# EAGLE design main (EAGLE 7.3.0)
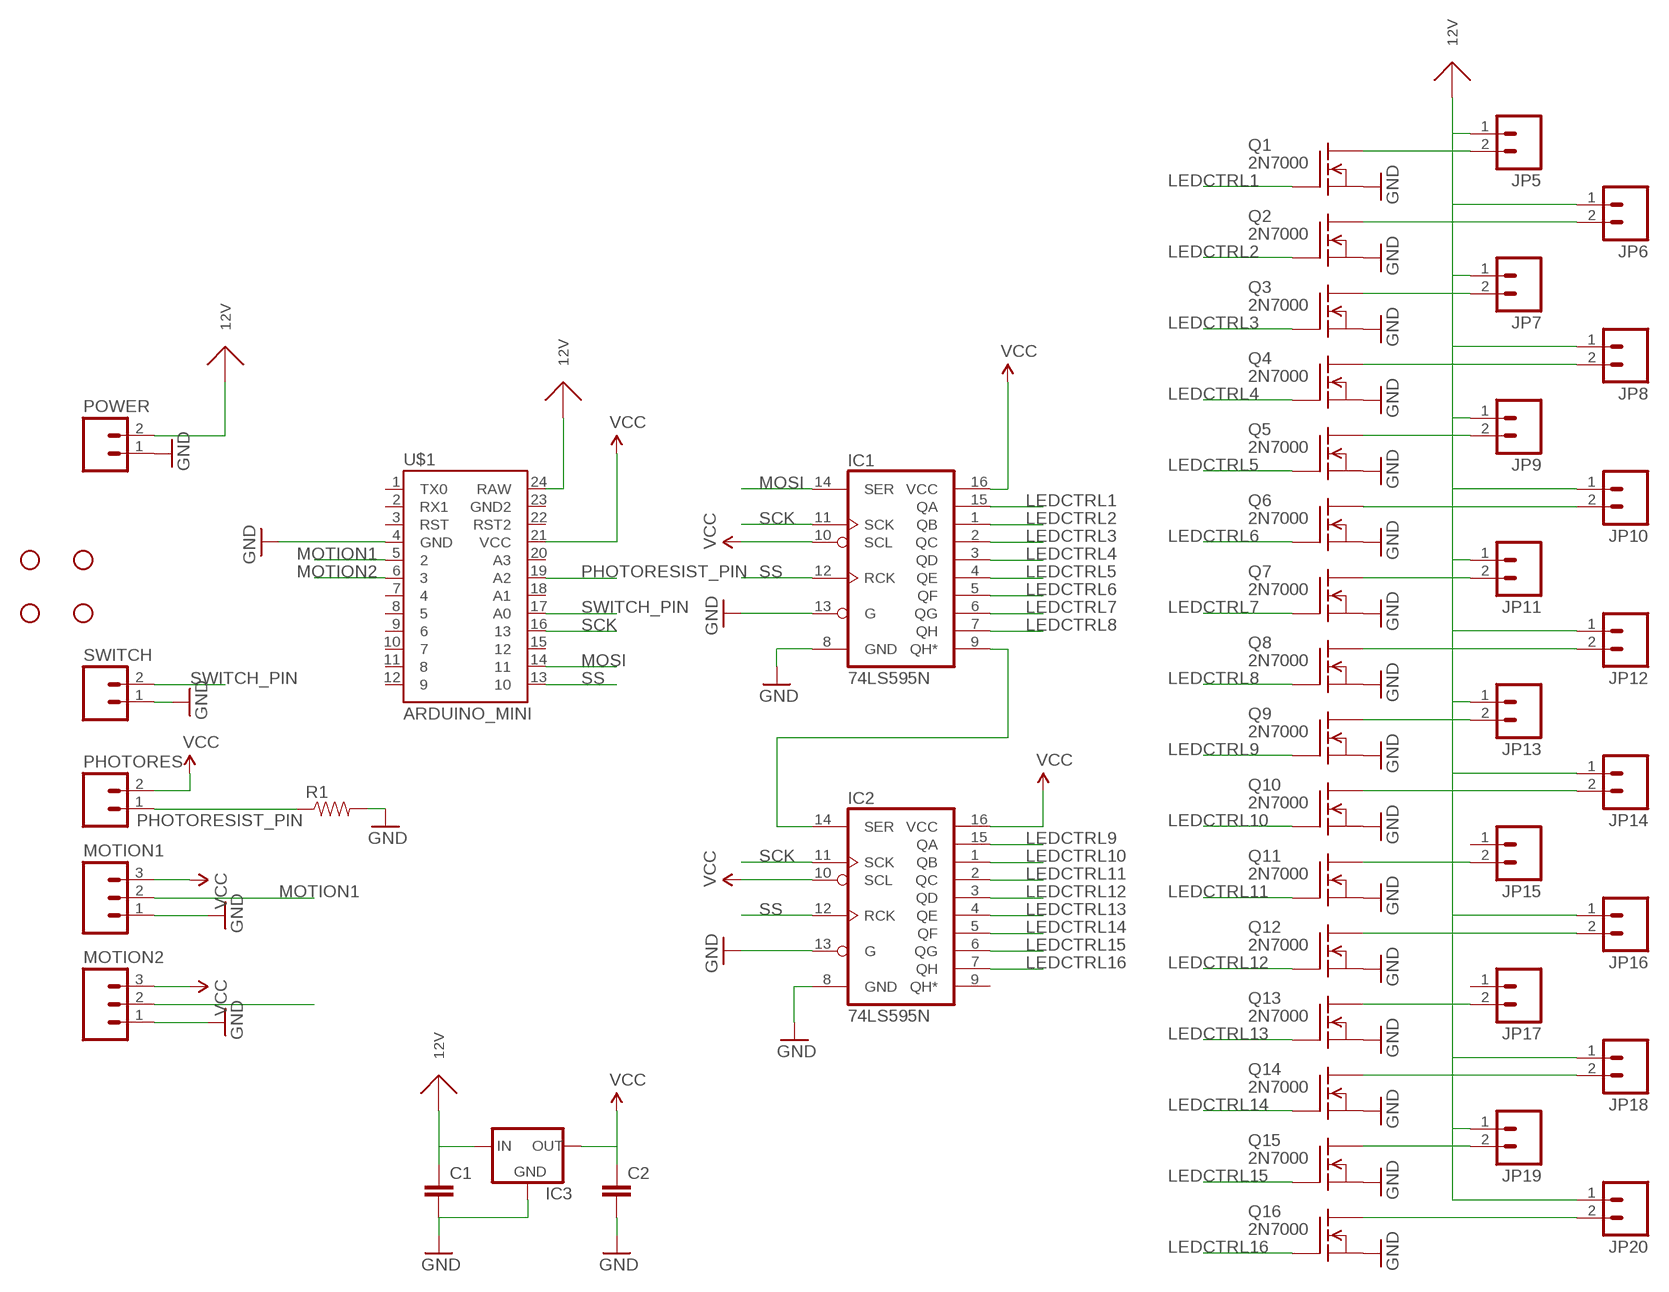
[diagram p0: schematic, sheet 1]

## Parts
C1  CAPKIT  [CAP-PTH-SMALL-KIT]
C2  CAPKIT  [CAP-PTH-SMALL-KIT]
IC1  74LS595N  [DIL16]
IC2  74LS595N  [DIL16]
IC3  V_REG_78XXSINK  [TO220-IGO]
JP1  STAND-OFF  [STAND-OFF]
JP2  STAND-OFF  [STAND-OFF]
JP3  STAND-OFF  [STAND-OFF]
JP4  STAND-OFF  [STAND-OFF]
JP5  M02PTH  [1X02]
JP6  M02PTH  [1X02]
JP7  M02PTH  [1X02]
JP8  M02PTH  [1X02]
JP9  M02PTH  [1X02]
JP10  M02PTH  [1X02]
JP11  M02PTH  [1X02]
JP12  M02PTH  [1X02]
JP13  M02PTH  [1X02]
JP14  M02PTH  [1X02]
JP15  M02PTH  [1X02]
JP16  M02PTH  [1X02]
JP17  M02PTH  [1X02]
JP18  M02PTH  [1X02]
JP19  M02PTH  [1X02]
JP20  M02PTH  [1X02]
MOTION1  M03PTH  [1X03]
MOTION2  M03PTH  [1X03]
PHOTORES  M02PTH  [1X02]
POWER  M025MM  [SCREWTERMINAL-5MM-2]
Q1  2N7000  [TO92]
Q2  2N7000  [TO92]
Q3  2N7000  [TO92]
Q4  2N7000  [TO92]
Q5  2N7000  [TO92]
Q6  2N7000  [TO92]
Q7  2N7000  [TO92]
Q8  2N7000  [TO92]
Q9  2N7000  [TO92]
Q10  2N7000  [TO92]
Q11  2N7000  [TO92]
Q12  2N7000  [TO92]
Q13  2N7000  [TO92]
Q14  2N7000  [TO92]
Q15  2N7000  [TO92]
Q16  2N7000  [TO92]
R1  RESISTORAXIAL-0.3  [AXIAL-0.3]
SWITCH  M02PTH  [1X02]
U$1  ARDUINO_MINI  [ARDUINO_MINI]

## Nets
12V: C1.1 IC3.IN JP5.1 JP6.1 JP7.1 JP8.1 JP9.1 JP10.1 JP11.1 JP12.1 JP13.1 JP14.1 JP16.1 JP18.1 JP19.1 JP20.1 POWER.2 U$1.24(RAW)
GND: C1.2 C2.2 IC1.8(GND) IC1.13(G) IC2.8(GND) IC2.13(G) IC3.GND MOTION1.1 MOTION2.1 POWER.1 Q1.1(S) Q2.1(S) Q3.1(S) Q4.1(S) Q5.1(S) Q6.1(S) Q7.1(S) Q8.1(S) Q9.1(S) Q10.1(S) Q11.1(S) Q12.1(S) Q13.1(S) Q14.1(S) Q15.1(S) Q16.1(S) R1.P$2 SWITCH.1 U$1.4(GND)
LEDCTRL1: IC1.15(QA) Q1.2(G)
LEDCTRL2: IC1.1(QB) Q2.2(G)
LEDCTRL3: IC1.2(QC) Q3.2(G)
LEDCTRL4: IC1.3(QD) Q4.2(G)
LEDCTRL5: IC1.4(QE) Q5.2(G)
LEDCTRL6: IC1.5(QF) Q6.2(G)
LEDCTRL7: IC1.6(QG) Q7.2(G)
LEDCTRL8: IC1.7(QH) Q8.2(G)
LEDCTRL9: IC2.15(QA) Q9.2(G)
LEDCTRL10: IC2.1(QB) Q10.2(G)
LEDCTRL11: IC2.2(QC) Q11.2(G)
LEDCTRL12: IC2.3(QD) Q12.2(G)
LEDCTRL13: IC2.4(QE) Q13.2(G)
LEDCTRL14: IC2.5(QF) Q14.2(G)
LEDCTRL15: IC2.6(QG) Q15.2(G)
LEDCTRL16: IC2.7(QH) Q16.2(G)
MOSI: IC1.14(SER) U$1.14
MOTION1: MOTION1.2 U$1.5
MOTION2: MOTION2.2 U$1.6
N$2: IC1.9(QH*) IC2.14(SER)
N$3: JP5.2 Q1.3(D)
N$4: JP6.2 Q2.3(D)
N$5: JP7.2 Q3.3(D)
N$6: JP8.2 Q4.3(D)
N$7: JP9.2 Q5.3(D)
N$8: JP10.2 Q6.3(D)
N$9: JP11.2 Q7.3(D)
N$10: JP12.2 Q8.3(D)
N$11: JP13.2 Q9.3(D)
N$12: JP14.2 Q10.3(D)
N$13: JP15.2 Q11.3(D)
N$14: JP16.2 Q12.3(D)
N$15: JP17.2 Q13.3(D)
N$16: JP18.2 Q14.3(D)
N$17: JP20.2 Q16.3(D)
N$18: JP19.2 Q15.3(D)
PHOTORESIST_PIN: PHOTORES.1 R1.P$1 U$1.19(A2)
SCK: IC1.11(SCK) IC2.11(SCK) U$1.16
SS: IC1.12(RCK) IC2.12(RCK) U$1.13
SWITCH_PIN: SWITCH.2 U$1.17(A0)
VCC: C2.1 IC1.10(SCL) IC1.16(VCC) IC2.10(SCL) IC2.16(VCC) IC3.OUT MOTION1.3 MOTION2.3 PHOTORES.2 U$1.21(VCC)
Unconnected: IC2.9(QH*) JP15.1 JP17.1 U$1.1(TX0) U$1.2(RX1) U$1.3(RST) U$1.7 U$1.8 U$1.9 U$1.10 U$1.11 U$1.12 U$1.15 U$1.18(A1) U$1.20(A3) U$1.22(RST2) U$1.23(GND2)

## Library data of the parts
C1 C2 = SparkFun:CAP: Capacitor Standard 0603 ceramic capacitor, and 0.1" leaded capacitor.
IC1 IC2 = SparkFun:74*595: 8-bit SHIFT REGISTER, output latch
IC3 = SparkFun:V_REG_78XX: Voltage Regulator Standard 7805 5V regulator. IGO (Input Ground Output). Spark Fun Electronics SKU : COM-00107
JP1-JP4 = SparkFun:STAND-OFF: Stand Off This is the mechanical footprint for a #4 phillips button head screw. Use the keepout ring to avoid running the screw head into surrounding components. SKU : PRT-00447
JP5-JP20 PHOTORES POWER SWITCH = SparkFun:M02: Header 2 Standard 2-pin 0.1" header. Use with straight break away headers (SKU : PRT-00116), right angle break away headers (PRT-00553), swiss pins (PRT-00743), machine pins (PRT-00117), and female headers (PRT-00115). Molex polarized connector foot print use with SKU : PRT-08233 with associated crimp pins and housings.
MOTION1 MOTION2 = SparkFun:M03: Header 3 Standard 3-pin 0.1" header. Use with straight break away headers (SKU : PRT-00116), right angle break away headers (PRT-00553), swiss pins (PRT-00743), machine pins (PRT-00117), and female headers (PRT-00115). Molex polarized connector foot print use with SKU : PRT-08232 with associated crimp pins and housings.
Q1-Q16 = com.andrew.eagleLibrary:2N7000: N-Channel Enhancement MOSFET not checked
R1 = SparkFun:RESISTOR: Resistor Basic schematic elements and footprints for 0603, 1206, and PTH resistors.
U$1 = SparkFun:ARDUINO_MINI

## Board
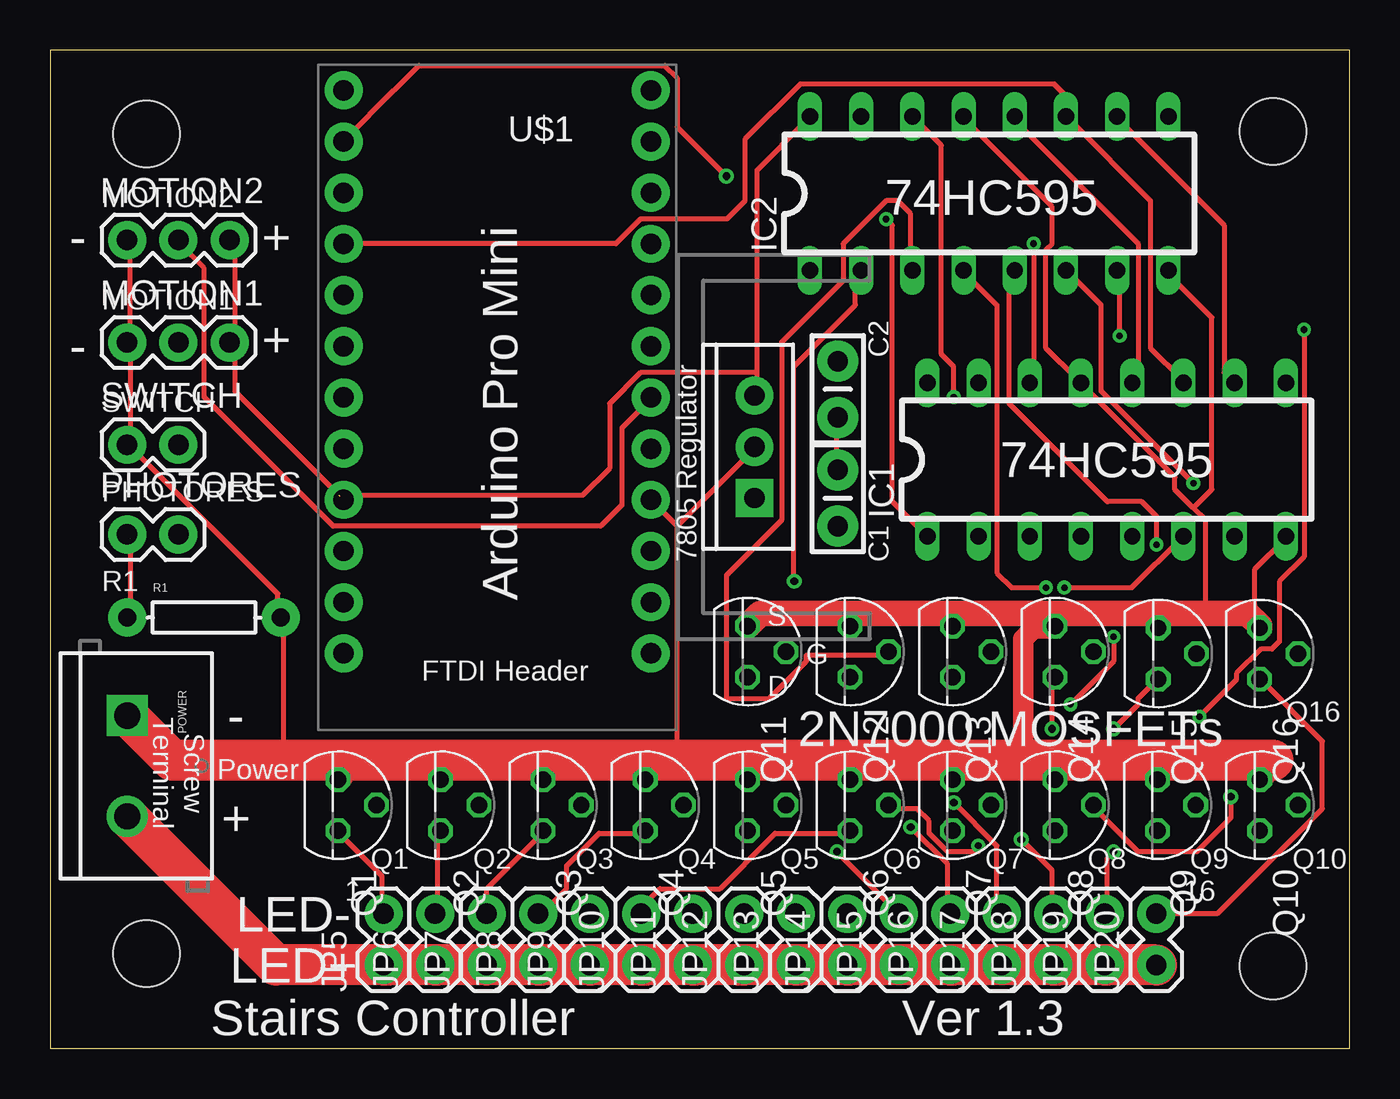
[diagram p1: board, top side]
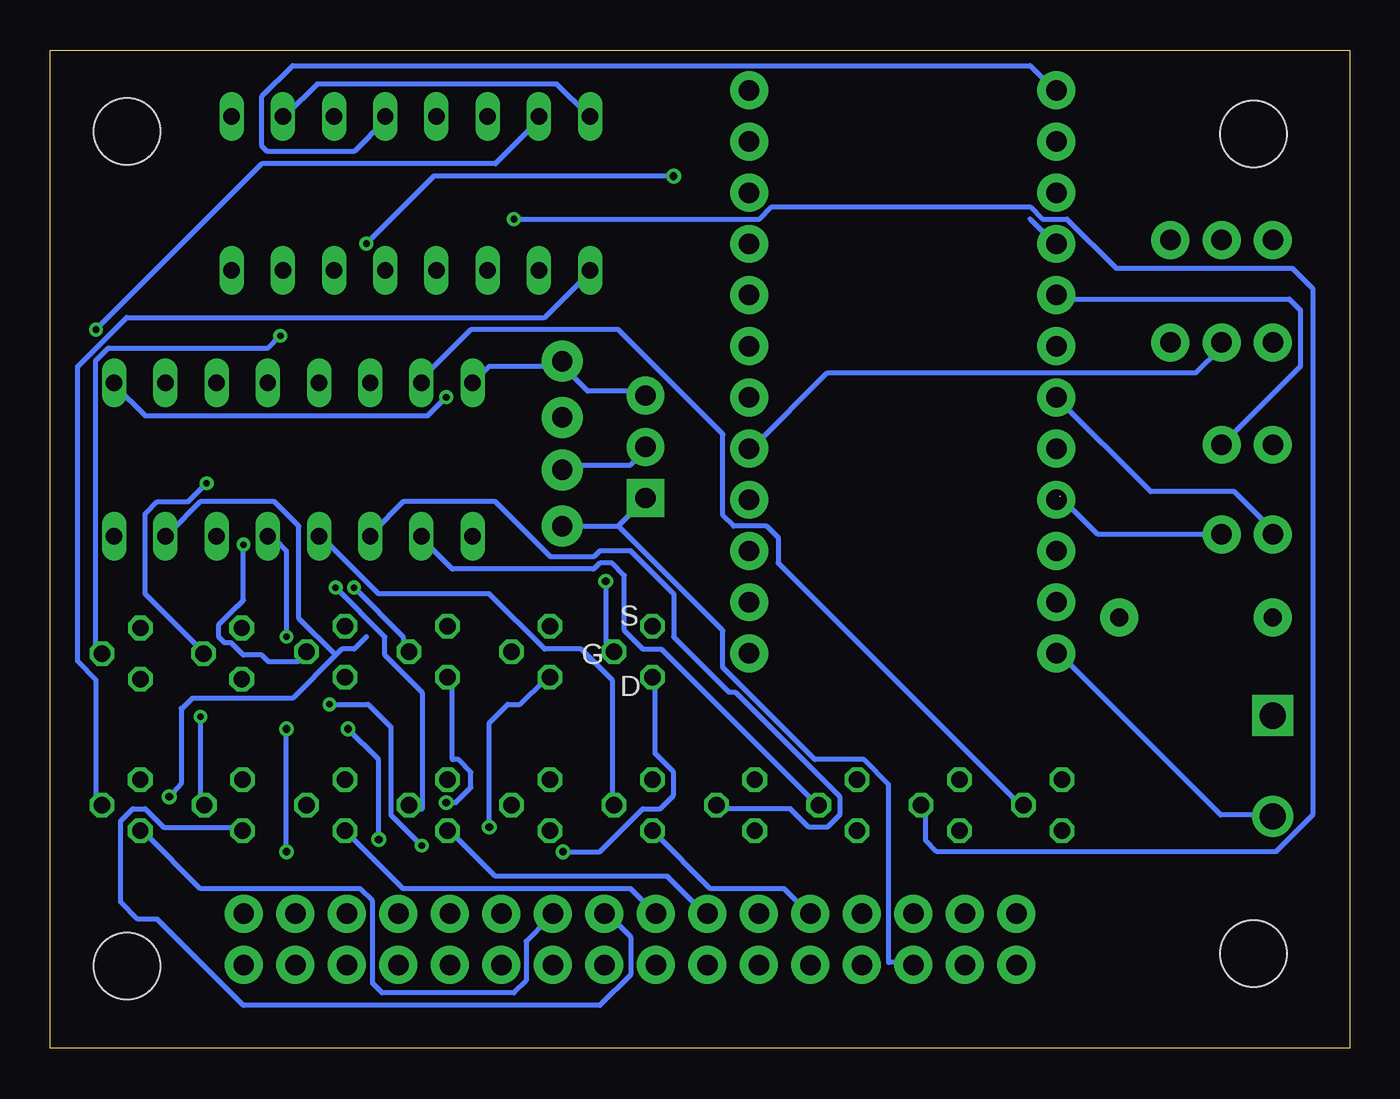
[diagram p2: board, bottom side, seen from below]

Size 64.44 x 49.52 mm. Coordinates in mm from the lower left corner, seen from the top.
Outline: 0,0 64.44,0 64.44,49.52 0,49.52 0,0
Copper layers (1*16): Top 0.0356mm / dielectric 1.5011mm / Bottom 0.0356mm
Design rules "LaenPCBOrder *": minimum track width 10mil, minimum drill 13mil, track to track 6mil, track to pad 6mil, pad to pad 6mil, via to via 6mil, smd to smd 6mil, copper to edge 15mil, drill to drill 6mil, minimum pad ring 7mil, minimum via ring 7mil, stop-mask expansion 4mil, vias tented up to drill 0mil, thermal gap 10mil

### Footprints (pad centres in the part's own frame; a part is rotated, then mirrored left to right if it is on the bottom)
CAP-PTH-SMALL-KIT = drill 1.016 pad 2.032: 1 -1.397,0; 2 1.397,0
DIL16 = drill 0.813 long: 1 -8.89,-3.81; 2 -6.35,-3.81; 3 -3.81,-3.81; 4 -1.27,-3.81; 5 1.27,-3.81; 6 3.81,-3.81; 7 6.35,-3.81; 8 8.89,-3.81; 9 8.89,3.81; 10 6.35,3.81; 11 3.81,3.81; 12 1.27,3.81; 13 -1.27,3.81; 14 -3.81,3.81; 15 -6.35,3.81; 16 -8.89,3.81
TO220-IGO = drill 1 pad 1.88: GND 0,0; OUT 2.54,0 | drill 1 pad 1.88 square: IN -2.54,0
STAND-OFF = hole 3.302: 0,0
1X02 = drill 1.016 pad 1.88: 1 0,0; 2 2.54,0
1X03 = drill 1.016 pad 1.88: 1 0,0; 2 2.54,0; 3 5.08,0
SCREWTERMINAL-5MM-2 = drill 1.3 pad 2.032 square: 1 0,0 | drill 1.3 pad 2.032: 2 5,0
TO92 = drill 0.813 octagon: 1 -1.27,0; 2 0,1.905; 3 1.27,0
AXIAL-0.3 = drill 0.9 pad 1.88: P$1 -3.81,0; P$2 3.81,0
ARDUINO_MINI = drill 1.016 pad 1.88: 1 -7.62,12.7; 2 -7.62,10.16; 3 -7.62,7.62; 4 -7.62,5.08; 5 -7.62,2.54; 6 -7.62,0; 7 -7.62,-2.54; 8 -7.62,-5.08; 9 -7.62,-7.62; 10 -7.62,-10.16; 11 -7.62,-12.7; 12 -7.62,-15.24; 13 7.62,-15.24; 14 7.62,-12.7; 15 7.62,-10.16; 16 7.62,-7.62; 17 7.62,-5.08; 18 7.62,-2.54; 19 7.62,0; 20 7.62,2.54; 21 7.62,5.08; 22 7.62,7.62; 23 7.62,10.16; 24 7.62,12.7

### Placement (x,y rotation side)
C1  39.05,27.3 90 top
C2  39.05,32.7 270 top
IC1  52.39,29.21 0 top
IC2  46.56,42.42 0 top
IC3  34.92,29.84 90 top
JP1  60.65,45.5 0 top
JP2  4.77,45.38 0 top
JP3  60.65,4.09 0 top
JP4  4.77,4.71 0 top
JP5  16.52,4.13 90 top
JP6  19.08,4.13 90 top
JP7  21.64,4.13 90 top
JP8  24.19,4.13 90 top
JP9  26.75,4.13 90 top
JP10  29.3,4.13 90 top
JP11  31.86,4.13 90 top
JP12  34.41,4.13 90 top
JP13  36.97,4.13 90 top
JP14  39.52,4.13 90 top
JP15  42.08,4.13 90 top
JP16  44.63,4.13 90 top
JP17  47.19,4.13 90 top
JP18  49.74,4.13 90 top
JP19  52.3,4.13 90 top
JP20  54.85,4.13 90 top
MOTION1  3.81,35.03 0 top
MOTION2  3.81,40.11 0 top
PHOTORES  3.81,25.5 0 top
POWER  3.81,16.51 270 top
Q1  14.27,12.06 270 top
Q2  19.34,12.06 270 top
Q3  24.43,12.06 270 top
Q4  29.5,12.06 270 top
Q5  34.59,12.06 270 top
Q6  39.66,12.06 270 top
Q7  44.74,12.06 270 top
Q8  49.83,12.06 270 top
Q9  54.91,12.06 270 top
Q10  59.98,12.06 270 top
Q11  34.59,19.68 270 top
Q12  39.66,19.68 270 top
Q13  44.74,19.68 270 top
Q14  49.83,19.68 270 top
Q15  54.95,19.59 270 top
Q16  59.98,19.59 270 top
R1  7.62,21.37 0 top
SWITCH  3.81,29.95 0 top
U$1  22.16,32.3 180 top

### Tracks (layer width: path | path; a pad name or v marks a point on that pad's centre or on a via)
12V
  Top 0.254: JP5.1 16.76,4.27 16.76,4.13 | 34.14,4.13 34.14,4.27 JP12.1 | JP6.1 19.2,4.27 19.2,4.13 | JP7.1 21.64,4.27 JP7.1 | JP8.1 24.38,4.27 24.38,4.13 | JP9.1 26.82,4.27 26.82,4.13 | JP10.1 29.57,4.27 29.57,4.13 | JP11.1 32,4.27 32,4.13 | JP13.1 37.19,4.27 37.19,4.13 | JP14.1 39.62,4.27 39.62,4.13 | JP16.1 44.81,4.27 44.81,4.13 | JP18.1 49.99,4.27 49.99,4.13 | JP19.1 52.43,4.27 52.43,4.13
  Top 2.032: JP20.1 52.43,4.13 JP19.1 49.99,4.13 JP18.1 44.81,4.13 JP16.1 39.62,4.13 JP14.1 37.19,4.13 JP13.1 JP12.1 34.14,4.13 32,4.13 JP11.1 29.57,4.13 JP10.1 26.82,4.13 JP9.1 24.38,4.13 JP8.1 JP7.1 19.2,4.13 JP6.1 16.76,4.13 JP5.1 11.19,4.13 POWER.2
  Bottom 0.254: U$1.24 14.33,19.51 6.4,11.58 3.96,11.58 POWER.2 | 36.27,25.91 35.05,27.13 IC3.IN | C1.1 36.27,25.91 | 36.27,25.91 31.09,20.73 31.09,18.9 26.52,14.33 24.08,14.33 22.86,13.11 22.86,4.27 21.64,4.27 JP7.1
GND
  Top 0.254: MOTION2.1 3.96,39.93 3.96,35.05 MOTION1.1 3.96,34.75 3.96,30.18 SWITCH.1 3.96,29.87 11.28,22.55 11.28,21.64 R1.P$2 11.58,21.34 11.58,14.29 | Q15.1 55.17,21.03 55.17,21.59 | Q2.1 19.51,13.41 19.51,14.29 | 54.86,14.29 54.86,13.41 Q9.1 | Q3.1 24.38,13.41 24.38,14.29 | Q4.1 29.57,13.41 29.57,14.29 | Q5.1 34.75,13.41 34.75,14.29 | Q6.1 39.62,13.41 39.62,14.29 | Q7.1 44.81,13.41 44.81,14.29 | Q8.1 49.99,13.41 49.99,14.29 | 48.46,21.59 48.46,21.34 48.9,20.95 | Q12.1 39.62,21.03 39.62,21.59 | Q13.1 44.81,21.03 44.81,21.59 | 31.09,25.91 29.87,27.13 U$1.4 | 31.09,14.29 31.09,25.91 | C2.2 39.01,31.09 39.01,28.96 C1.2 | 56.69,26.82 57.3,26.21 57.3,21.59 | 56.69,26.82 55.78,27.74 55.78,28.35 51.21,32.92 IC1.13 50.9,33.22 49.38,34.75 49.38,39.62 49.68,39.93 49.68,41.76 45.41,46.02 IC2.13 | 56.69,26.82 57.61,27.74 57.61,36.27 55.47,38.41 IC2.8 | IC1.8 61.27,25.3 59.74,23.77 59.74,21.95 59.37,21.59 | 31.09,25.91 34.75,29.57 IC3.GND
  Top 1.016: 48.9,20.95 48.26,20.32 48.26,14.92
  Top 1.27: Q16.1 59.98,20.98 59.37,21.59 57.3,21.59 55.17,21.59 48.46,21.59 44.81,21.59 39.62,21.59 35.22,21.59 Q11.1 | Q10.1 59.98,13.36 60.64,14.29 | 14.9,14.29 Q1.1 | Q14.1 48.9,20.95 | 48.26,14.92 46.67,14.29
  Top 2.032: 60.64,14.29 54.86,14.29 49.99,14.29 46.67,14.29 44.81,14.29 39.62,14.29 34.75,14.29 31.09,14.29 29.57,14.29 24.38,14.29 19.51,14.29 14.9,14.29 11.58,14.29 6.03,14.29 POWER.1
  Bottom 0.254: IC3.GND 35.05,29.57 35.66,28.96 39.01,28.96 C1.2
LEDCTRL1
  Bottom 0.254: Q1.2 16.46,12.19 28.35,24.08 28.35,25.35 28.9,25.91 30.56,25.91 31.09,26.44 31.09,30.48 36.27,35.66 43.59,35.66 46.02,33.22 IC1.15
LEDCTRL2  (via drill 0.33)
  Top 0.254: v41.45,41.15 41.76,40.84 41.76,27.13 43.28,25.6 IC1.1
  Bottom 0.254: v41.45,41.15 29.26,41.15 28.65,41.76 15.85,41.76 15.24,41.15 14.02,41.15 11.58,38.71 2.84,38.71 1.83,37.7 1.83,11.58 3.66,9.75 20.46,9.75 21.03,10.32 21.03,11.89 Q2.2
LEDCTRL3
  Bottom 0.254: Q3.2 26.52,12.19 34.14,19.81 35.05,19.81 35.97,20.73 35.97,23.47 36.58,24.08 37.19,24.08 37.49,23.77 44.5,23.77 46.02,25.3 IC1.2
LEDCTRL4
  Bottom 0.254: Q4.2 31.39,11.89 27.74,11.89 26.82,10.97 25.91,10.97 25.3,11.58 25.3,12.5 30.48,17.68 30.79,17.68 33.53,20.42 33.53,22.55 35.66,24.69 37.19,24.69 37.49,24.38 39.62,24.38 42.37,27.13 46.94,27.13 48.46,25.6 IC1.3
LEDCTRL5
  Bottom 0.254: Q5.2 36.58,12.19 36.58,18.29 38.1,19.81 39.93,19.81 42.67,22.55 48.16,22.55 50.9,25.3 IC1.4
LEDCTRL6  (via drill 0.33)
  Top 0.254: v46.02,10.06 46.02,9.75 44.5,9.75 43.59,10.67 43.59,11.28 42.98,11.89 41.76,11.89 Q6.2 | v50.6,17.07 52.73,19.2 v52.73,20.42
  Bottom 0.254: v46.02,10.06 47.55,11.58 47.55,15.94 48.68,17.07 v50.6,17.07 | v52.73,20.42 52.73,24.69 53.34,25.3 53.65,25.3 IC1.5
LEDCTRL7  (via drill 0.33)
  Top 0.254: v50.29,22.86 53.65,22.86 56.08,25.3 IC1.6
  Bottom 0.254: Q7.2 46,11.87 46,17.65 47.85,19.51 47.85,20.42 v50.29,22.86
LEDCTRL8  (via drill 0.38)
  Top 0.254: v58.55,12.48 58.55,11.92 58.55,11.44 56.86,9.75 53.95,9.75 51.82,11.89 Q8.2
  Bottom 0.254: v58.55,12.48 57.95,13.14 57.95,16.87 57.91,16.87 57.41,17.37 52.43,17.37 50.29,19.51 | 50.29,19.51 49.99,19.81 49.38,19.81 48.77,20.42 | 50.29,19.51 52.12,21.34 52.12,25.91 53.34,27.13 57,27.13 58.52,25.6 IC1.7
LEDCTRL9  (via drill 0.33)
  Top 0.254: v57,16.46 58.83,18.29 58.83,18.59 60.05,19.81 60.59,19.81 60.96,20.18 60.96,23.16 62.18,24.38 v62.18,35.66
  Bottom 0.254: v57,16.46 57,12.19 Q9.2 | v62.18,35.66 53.95,43.89 42.37,43.89 40.23,46.02 IC2.15
LEDCTRL10
  Bottom 0.254: Q10.2 62.18,12.19 62.18,18.29 63.09,19.2 63.09,33.83 60.66,36.27 39.93,36.27 37.8,38.41 IC2.1
LEDCTRL11  (via drill 0.38)
  Top 0.254: IC2.2 39.93,38.41 39.93,36.88 36.88,33.83 36.88,23.47 v36.89,23.18
  Bottom 0.254: v36.89,23.18 36.89,20.13 Q11.2
LEDCTRL12
  Top 0.254: Q12.2 41.45,19.51 37.49,19.51 37.49,19.2 35.66,17.37 33.53,17.37 33.53,23.47 36.27,26.21 36.27,35.05 39.32,38.1 39.32,39.93 41.45,42.06 42.02,42.06 42.67,41.42 42.67,38.71 IC2.3
LEDCTRL13  (via drill 0.33)
  Top 0.254: v49.38,22.86 47.67,22.86 46.94,23.59 46.94,36.88 45.41,38.41 IC2.4
  Bottom 0.254: v49.38,22.86 46.94,20.42 46.94,19.81 Q13.2
LEDCTRL14  (via drill 0.33)
  Top 0.254: v54.86,24.99 54.86,26.39 54.13,27.13 52.43,27.13 47.55,32 47.55,38.41 IC2.5
  Bottom 0.254: Q14.2 51.82,19.51 52.12,19.2 53.65,19.2 53.95,19.51 54.86,19.51 55.47,20.12 55.8,20.12 56.08,20.4 56.08,21.03 55.17,21.95 55.15,21.95 54.86,22.23 v54.86,24.99
LEDCTRL15  (via drill 0.33)
  Top 0.254: v56.69,28.04 52.12,32.61 52.12,36.88 50.6,38.41 IC2.6
  Bottom 0.254: 56.69,19.81 Q15.2 57,19.81 59.74,22.55 59.74,26.52 59.13,27.13 57.61,27.13 v56.69,28.04
LEDCTRL16  (via drill 0.33)
  Top 0.254: v53.03,35.36 53.03,38.41 IC2.7
  Bottom 0.254: 61.87,19.81 Q16.2 62.18,19.81 62.18,34.14 61.57,34.75 53.65,34.75 v53.03,35.36
MOSI  (via drill 0.33, 0.38)
  Top 0.254: U$1.14 14.63,45.11 15.85,46.33 15.85,46.35 18.27,48.77 30.48,48.77 31.09,48.16 31.09,45.72 v33.53,43.28 | v48.77,39.93 48.77,33.22 IC1.14
  Bottom 0.254: v48.77,39.93 45.41,43.28 v33.53,43.28
MOTION1
  Bottom 0.254: MOTION1.2 6.4,34.75 7.62,33.53 25.91,33.53 29.57,29.87 U$1.5
MOTION2
  Top 0.254: MOTION2.2 6.4,39.93 7.62,38.71 7.62,32.31 14.02,25.91 27.3,25.91 28.35,26.96 28.35,30.79 29.57,32 U$1.6
N$2  (via drill 0.33)
  Top 0.254: v44.81,32.31 44.81,33.83 44.2,34.44 44.2,44.81 42.98,46.02 IC2.14
  Bottom 0.254: v44.81,32.31 45.72,31.39 59.74,31.39 61.27,32.92 IC1.9
N$3
  Top 0.254: Q1.3 14.33,10.67 16.46,8.53 16.46,6.71 JP5.2
N$4
  Top 0.254: Q2.3 19.2,10.67 19.2,6.71 JP6.2
N$5
  Top 0.254: Q3.3 24.38,10.67 21.64,7.92 21.64,6.71 JP7.2
N$6
  Top 0.254: Q4.3 29.26,10.67 27.21,10.67 25.6,9.06 25.6,7.92 24.38,6.71 JP8.2
N$7
  Bottom 0.254: Q5.3 34.44,10.67 31.7,7.92 28.04,7.92 26.82,6.71 JP9.2
N$8
  Top 0.254: Q6.3 39.62,10.67 35.95,10.67 35.66,10.38 35.66,10.36 33.22,7.92 30.24,7.92 29.57,7.25 29.57,6.71 JP10.2
N$9
  Bottom 0.254: Q7.3 44.5,10.67 42.37,8.53 33.83,8.53 32,6.71 JP11.2
N$10
  Bottom 0.254: Q8.3 49.68,10.67 46.94,7.92 35.66,7.92 34.44,6.71 JP12.2
N$11
  Bottom 0.254: Q9.3 55.17,10.97 58.83,10.97 59.74,11.89 60.35,11.89 60.96,11.28 60.96,7.26 60.1,6.4 59.13,6.4 54.86,2.13 37.19,2.13 35.66,3.66 35.66,5.53 36.53,6.4 36.88,6.4 JP13.2
N$12
  Bottom 0.254: Q10.3 59.74,10.67 57,7.92 49.07,7.92 48.46,7.32 48.46,3.22 47.99,2.74 41.45,2.74 40.84,3.35 40.84,5.32 39.76,6.4 39.62,6.4 JP14.2
N$13  (via drill 0.38)
  Top 0.254: v39.01,9.75 42.06,6.71 JP15.2
  Bottom 0.254: v39.01,9.75 37.19,9.75 35.05,11.89 34.19,11.89 33.53,12.55 33.53,13.72 34.44,14.63 34.44,18.29 Q11.3
N$14  (via drill 0.38)
  Top 0.254: v42.67,10.97 44.5,9.14 44.5,6.71 JP16.2
  Bottom 0.254: v42.67,10.97 42.67,16.15 41.76,17.07 41.15,17.07 39.93,18.29 Q12.3
N$15  (via drill 0.38)
  Top 0.254: v44.81,12.19 46.94,10.06 46.94,6.71 JP17.2
  Bottom 0.254: v44.81,12.19 44.33,12.19 43.59,12.94 43.59,13.72 44.2,14.33 44.5,14.33 44.5,18.29 Q13.3
N$16  (via drill 0.38)
  Top 0.254: v49.68,15.85 49.68,18.29 Q14.3 | v48.16,10.36 49.68,8.84 49.68,6.71 JP18.2
  Bottom 0.254: v49.68,15.85 48.16,14.33 v48.16,10.36
N$17
  Top 0.254: Q16.3 60.05,18.29 63.09,15.24 63.09,11.89 57.91,6.71 54.86,6.71 JP20.2
N$18  (via drill 0.38)
  Top 0.254: v52.73,15.85 53.95,17.07 53.95,17.37 54.86,18.29 Q15.3 | v52.73,9.75 52.43,9.45 52.43,6.71 JP19.2
  Bottom 0.254: v52.73,9.75 v52.73,15.85
PHOTORESIST_PIN  (1 unrouted)
  Top 0.254: R1.P$1 3.96,21.64 3.96,25.3 PHOTORES.1
  Bottom 0.254: 3.96,25.3 3.96,25.87 5.71,27.62 9.87,27.62 U$1.19
SCK
  Top 0.254: IC1.11 56.08,33.22 54.56,34.75 54.56,42.06 50.6,46.02 IC2.11 50.29,46.33 50.29,47.35 49.79,47.85 37.19,47.85 34.44,45.11 34.44,42.04 33.55,41.15 29.26,41.15 28.04,39.93 14.63,39.93 U$1.16
  Bottom 0.254: 15.85,41.15 14.63,39.93 U$1.16
SS
  Top 0.254: IC1.12 53.95,33.22 53.95,39.93 47.85,46.02 IC2.12
  Bottom 0.254: U$1.13 14.63,47.55 15.85,48.77 52.43,48.77 53.95,47.24 53.95,44.77 53.68,44.5 49.38,44.5 47.85,46.02 IC2.12
SWITCH_PIN
  Bottom 0.254: SWITCH.2 6.1,30.18 2.44,33.83 2.44,36.64 2.99,37.19 14.33,37.19 U$1.17
VCC  (1 unrouted)
  Top 0.254: MOTION2.3 9.14,39.93 9.14,35.05 MOTION1.3 9.14,34.75 9.14,32.61 14.33,27.43 U$1.21 14.63,27.43 26.39,27.43 27.74,28.78 27.74,32 29.26,33.53 35.05,33.53 | IC1.10 58.52,33.22 58.22,33.53 58.22,40.84 53.03,46.02 IC2.10 | 35.05,33.53 35.05,32.61 IC3.OUT | 35.05,33.53 35.05,43.59 37.49,46.02 IC2.16
  Bottom 0.254: IC1.16 43.28,33.22 42.67,33.83 39.32,33.83 C2.1 39.01,33.83 37.8,32.61 35.05,32.61 IC3.OUT | IC2.10 52.73,46.33 51.21,47.85 39.32,47.85 37.8,46.33 IC2.16 | PHOTORES.2 12.48,25.5 14.37,27.39

### Text on the board
tPlace: MOTION2 | 74HC595 | - | + | MOTION1 | - | + | C2 | SWITCH | 74HC595 | PHOTORES | 7805 Regulator | C1 | R1 | Arduino Pro Mini | S | FTDI Header | G | - | D | 2N7000 MOSFETs | Q16 | Screw / Terminal | Power | + | Q1 | Q2 | Q3 | Q4 | Q5 | Q6 | Q7 | Q8 | Q9 | Q10 | LED- | 1 | 16 | LED+ | Stairs Controller | Ver 1.3
bPlace: S | G | D